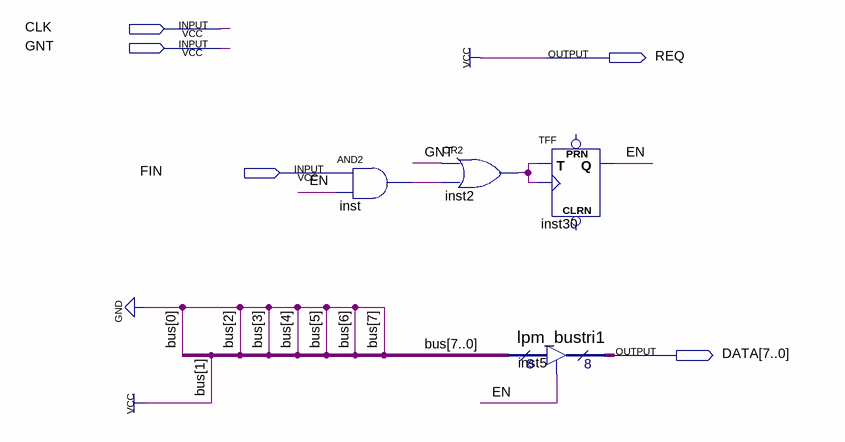
[diagram p0: schematic sheet]
// Quartus schematic master2.bdf as structural Verilog: 4 symbols, 5 pins
module master2 (
  input  CLK,
  input  GNT,
  input  FIN,
  output REQ,
  output [7:0] DATA
);

  wire EN, inst2_out, inst_out;

  and inst (inst_out, FIN, EN);
  or inst2 (inst2_out, GNT, inst_out);
  TFF inst30 (.T(inst2_out), .CLK(inst2_out), .Q(EN));  // open: PRN, CLRN
  lpm_bustri1 inst5 (.enabledt(EN), .data(8'b00000010), .tridata(DATA));

  assign REQ = 1'b1;
endmodule
